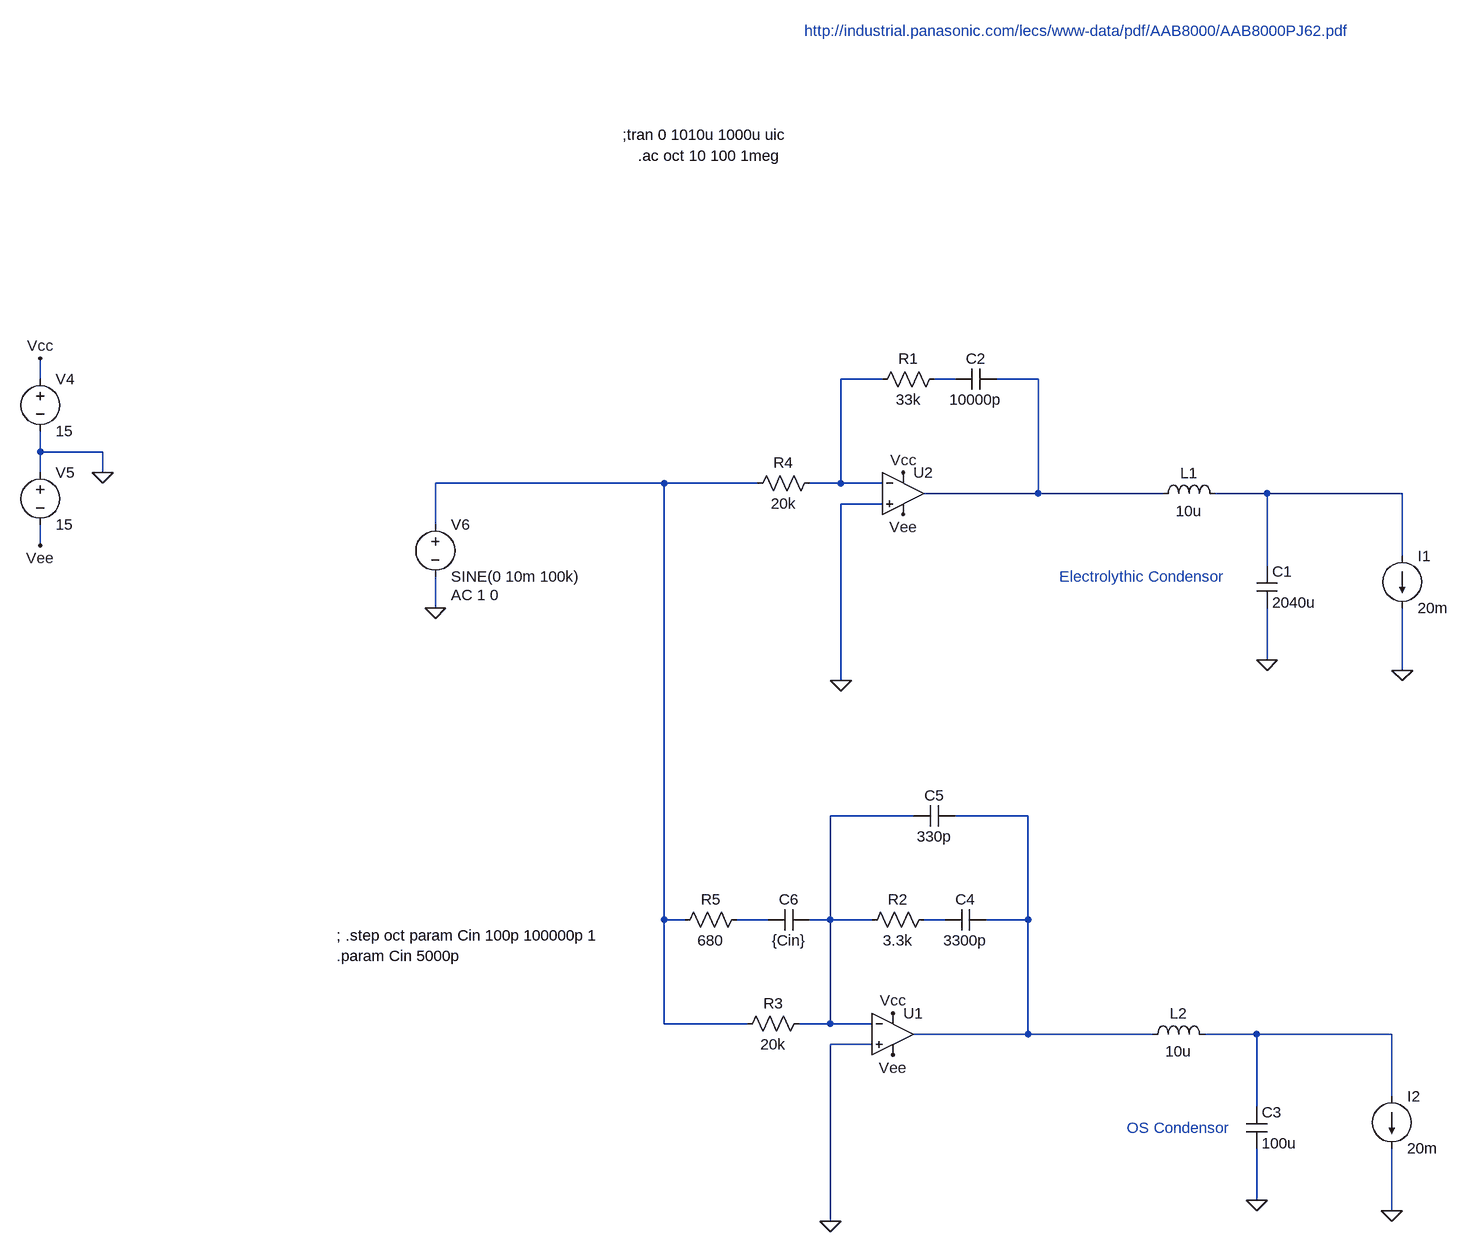
[diagram p0: schematic DC-DC PhaseComp_Panasonic.asc]
DC-DC PhaseComp_Panasonic.asc, the LTspice schematic file:
Version 4
SHEET 1 1416 1812
WIRE -1488 496 -1488 464
WIRE -192 496 -256 496
WIRE -80 496 -112 496
WIRE 48 496 -16 496
WIRE -1488 608 -1488 576
WIRE -1392 608 -1488 608
WIRE -1488 640 -1488 608
WIRE -1392 640 -1392 608
WIRE -528 656 -880 656
WIRE -384 656 -528 656
WIRE -256 656 -256 496
WIRE -256 656 -304 656
WIRE -192 656 -256 656
WIRE 48 672 48 496
WIRE 48 672 -128 672
WIRE 240 672 48 672
WIRE 400 672 320 672
WIRE 608 672 400 672
WIRE -192 688 -256 688
WIRE -880 720 -880 656
WIRE -1488 752 -1488 720
WIRE 608 768 608 672
WIRE 400 784 400 672
WIRE -880 848 -880 800
WIRE 400 928 400 848
WIRE 608 944 608 848
WIRE -256 960 -256 688
WIRE -144 1168 -272 1168
WIRE 32 1168 -80 1168
WIRE -528 1328 -528 656
WIRE -496 1328 -528 1328
WIRE -368 1328 -416 1328
WIRE -272 1328 -272 1168
WIRE -272 1328 -304 1328
WIRE -208 1328 -272 1328
WIRE -96 1328 -128 1328
WIRE 32 1328 32 1168
WIRE 32 1328 -32 1328
WIRE -528 1488 -528 1328
WIRE -400 1488 -528 1488
WIRE -272 1488 -272 1328
WIRE -272 1488 -320 1488
WIRE -208 1488 -272 1488
WIRE 32 1504 32 1328
WIRE 32 1504 -144 1504
WIRE 224 1504 32 1504
WIRE 384 1504 304 1504
WIRE 592 1504 384 1504
WIRE -208 1520 -272 1520
WIRE 592 1600 592 1504
WIRE 384 1616 384 1504
WIRE 384 1760 384 1680
WIRE 592 1776 592 1680
WIRE -272 1792 -272 1520
FLAG 400 928 0
FLAG 608 944 0
FLAG -256 960 0
FLAG -160 640 Vcc
FLAG -160 704 Vee
FLAG -1392 640 0
FLAG -1488 464 Vcc
FLAG -1488 752 Vee
FLAG -880 848 0
FLAG 384 1760 0
FLAG 592 1776 0
FLAG -272 1792 0
FLAG -176 1472 Vcc
FLAG -176 1536 Vee
SYMBOL ind 224 688 R270
WINDOW 0 32 56 VTop 2
WINDOW 3 5 56 VBottom 2
SYMATTR InstName L1
SYMATTR Value 10u
SYMBOL cap 384 784 R0
SYMATTR InstName C1
SYMATTR Value 2040u
SYMATTR SpiceLine Rser=43m
SYMBOL current 608 768 R0
WINDOW 123 0 0 Left 2
WINDOW 39 0 0 Left 2
SYMATTR InstName I1
SYMATTR Value 20m
SYMBOL Opamps\\UniversalOpamp2 -160 672 R0
SYMATTR InstName U2
SYMBOL res -96 480 R90
WINDOW 0 0 56 VBottom 2
WINDOW 3 32 56 VTop 2
SYMATTR InstName R1
SYMATTR Value 33k
SYMBOL res -288 640 R90
WINDOW 0 0 56 VBottom 2
WINDOW 3 32 56 VTop 2
SYMATTR InstName R4
SYMATTR Value 20k
SYMBOL voltage -1488 480 R0
WINDOW 123 0 0 Left 2
WINDOW 39 0 0 Left 2
SYMATTR InstName V4
SYMATTR Value 15
SYMBOL voltage -1488 624 R0
WINDOW 123 0 0 Left 2
WINDOW 39 0 0 Left 2
SYMATTR InstName V5
SYMATTR Value 15
SYMBOL voltage -880 704 R0
WINDOW 123 24 124 Left 2
WINDOW 39 0 0 Left 2
SYMATTR Value2 AC 1 0
SYMATTR InstName V6
SYMATTR Value SINE(0 10m 100k)
SYMBOL cap -16 480 R90
WINDOW 0 0 32 VBottom 2
WINDOW 3 32 32 VTop 2
SYMATTR InstName C2
SYMATTR Value 10000p
SYMBOL ind 208 1520 R270
WINDOW 0 32 56 VTop 2
WINDOW 3 5 56 VBottom 2
SYMATTR InstName L2
SYMATTR Value 10u
SYMBOL cap 368 1616 R0
SYMATTR InstName C3
SYMATTR Value 100u
SYMATTR SpiceLine Rser=32m
SYMBOL current 592 1600 R0
WINDOW 123 0 0 Left 2
WINDOW 39 0 0 Left 2
SYMATTR InstName I2
SYMATTR Value 20m
SYMBOL Opamps\\UniversalOpamp2 -176 1504 R0
SYMATTR InstName U1
SYMBOL res -112 1312 R90
WINDOW 0 0 56 VBottom 2
WINDOW 3 32 56 VTop 2
SYMATTR InstName R2
SYMATTR Value 3.3k
SYMBOL res -304 1472 R90
WINDOW 0 0 56 VBottom 2
WINDOW 3 32 56 VTop 2
SYMATTR InstName R3
SYMATTR Value 20k
SYMBOL cap -32 1312 R90
WINDOW 0 0 32 VBottom 2
WINDOW 3 32 32 VTop 2
SYMATTR InstName C4
SYMATTR Value 3300p
SYMBOL cap -80 1152 R90
WINDOW 0 0 32 VBottom 2
WINDOW 3 32 32 VTop 2
SYMATTR InstName C5
SYMATTR Value 330p
SYMBOL res -400 1312 R90
WINDOW 0 0 56 VBottom 2
WINDOW 3 32 56 VTop 2
SYMATTR InstName R5
SYMATTR Value 680
SYMBOL cap -304 1312 R90
WINDOW 0 0 32 VBottom 2
WINDOW 3 32 32 VTop 2
SYMATTR InstName C6
SYMATTR Value {Cin}
TEXT -592 120 Left 2 !;tran 0 1010u 1000u uic
TEXT -568 152 Left 2 !.ac oct 10 100 1meg
TEXT -312 -40 Left 2 ;http://industrial.panasonic.com/lecs/www-data/pdf/AAB8000/AAB8000PJ62.pdf
TEXT 80 800 Left 2 ;Electrolythic Condensor
TEXT 184 1648 Left 2 ;OS Condensor
TEXT -1032 1352 Left 2 !; .step oct param Cin 100p 100000p 1\n.param Cin 5000p

The netlist it stands for:
* DC-DC PhaseComp_Panasonic.asc
L1 N003 N005 10u
C1 N005 0 2040u Rser=43m
I1 N005 0 20m
XU2 0 N001 Vcc Vee N003 level.2 Avol=1Meg GBW=10Meg Slew=10Meg ilimit=25m rail=0 Vos=0 phimargin=45 en=0 enk=0 in=0 ink=0 Rin=500Meg  ; pins IN+ IN- V+ V- OUT
R1 N002 N001 33k
R4 N001 N004 20k
V4 Vcc 0 15
V5 0 Vee 15
V6 N004 0 SINE(0 10m 100k) AC 1 0
C2 N003 N002 10000p
L2 N007 N010 10u
C3 N010 0 100u Rser=32m
I2 N010 0 20m
XU1 0 N006 Vcc Vee N007 level.2 Avol=1Meg GBW=10Meg Slew=10Meg ilimit=25m rail=0 Vos=0 phimargin=45 en=0 enk=0 in=0 ink=0 Rin=500Meg  ; pins IN+ IN- V+ V- OUT
R2 N009 N006 3.3k
R3 N006 N004 20k
C4 N007 N009 3300p
C5 N007 N006 330p
R5 N008 N004 680
C6 N006 N008 {Cin}
;tran 0 1010u 1000u uic
.ac oct 10 100 1meg
* http://industrial.panasonic.com/lecs/www-data/pdf/AAB8000/AAB8000PJ62.pdf
* Electrolythic Condensor
* OS Condensor
; .step oct param Cin 100p 100000p 1
.param Cin 5000p
.lib UniversalOpamps2.sub
.backanno
.end